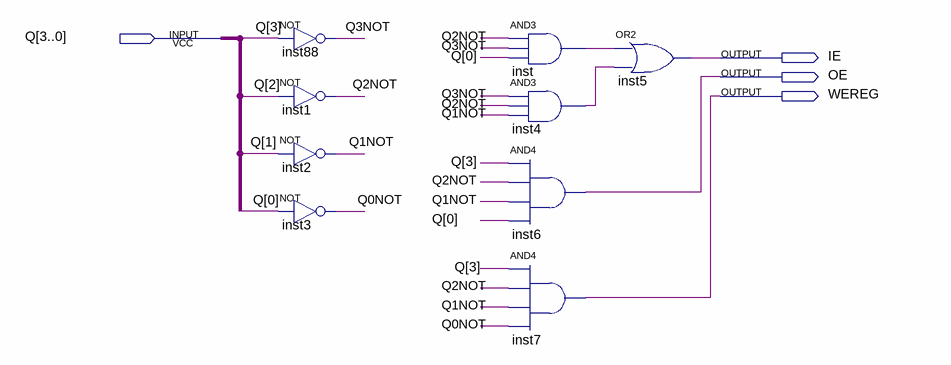
[diagram p0: schematic sheet]
// Quartus schematic ENABLE.bdf as structural Verilog: 9 symbols, 4 pins
module ENABLE (
  input  [3:0] Q,
  output IE,
  output OE,
  output WEREG
);

  wire inst4_out, inst_out, Q0NOT, Q1NOT, Q2NOT, Q3NOT;

  not inst88 (Q3NOT, Q[3]);
  not inst1 (Q2NOT, Q[2]);
  not inst2 (Q1NOT, Q[1]);
  not inst3 (Q0NOT, Q[0]);
  and inst (inst_out, Q2NOT, Q3NOT, Q[0]);
  and inst4 (inst4_out, Q3NOT, Q2NOT, Q1NOT);
  and inst6 (OE, Q[3], Q2NOT, Q1NOT, Q[0]);
  and inst7 (WEREG, Q[3], Q2NOT, Q1NOT, Q0NOT);
  or inst5 (IE, inst_out, inst4_out);
endmodule
